# Altium schematic sheet LDO.SchDoc
size A4; SheetNumber: 3; SheetTotal: 5
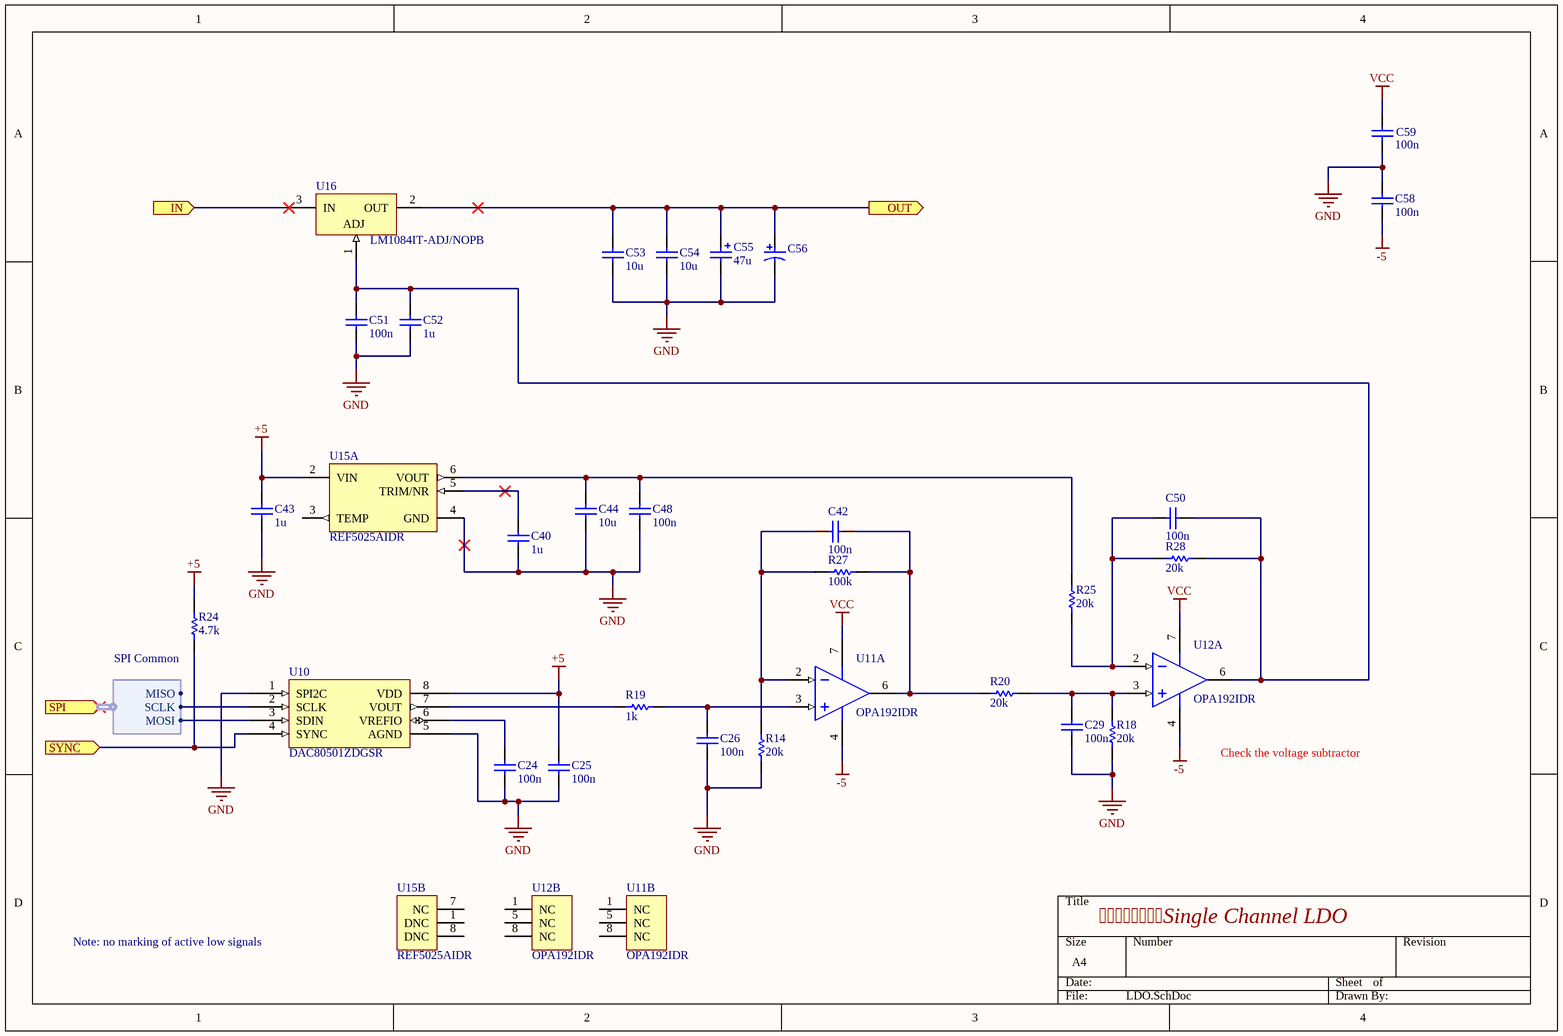
[diagram p0: LDO.SchDoc]

## Parts
C24  100n  [CAPC2013X145X50LL20T25]
C25  100n  [CAPC2013X145X50LL20T25]
C26  100n  [CAPC2013X145X50NL20T25]
C29  100n  [CAPC2013X145X50NL20T25]
C40  1u  [CAPC2013X140X50LL20T25]
C42  100n  [CAPC2013X145X50NL20T25]
C43  1u  [CAPC2013X140X50LL20T25]
C44  10u  [CAPC3216X180X55LL20T30]
C48  100n  [CAPC2013X145X50LL20T25]
C50  100n  [CAPC2013X145X50NL20T25]
C51  100n  [CAPC2013X145X50LL20T25]
C52  1u  [CAPC2013X140X50LL20T25]
C53  10u  [CAPC3216X180X55LL20T30]
C54  10u  [CAPC3216X180X55LL20T30]
C55  47u  [7343]
C56  ECA-1JHG471  [CAPPR65-500-2000X1250X2200]  (value not drawn)
C58  100n  [CAPC2013X145X50LL20T25]
C59  100n  [CAPC2013X145X50LL20T25]
R14  20k  [RESC2013X70X40NL20T20]
R18  20k  [RESC2013X70X40NL20T20]
R19  1k  [RESC2013X50X30NL20T20]
R20  20k  [RESC2013X70X40NL20T20]
R24  4.7k  [RESC2013X70X40NL20T20]
R25  20k  [RESC2013X70X40NL20T20]
R27  100k  [RESC2013X70X40NL20T20]
R28  20k  [RESC2013X70X40NL20T20]
U10  DAC80501ZDGSR  [MSOP10]
U11  OPA192IDR  [D0008A_M]  (parts A,B of 2)
U12  OPA192IDR  [D0008A_M]  (parts A,B of 2)
U15  REF5025AIDR  [D0008A_L]  (parts A,B of 2)
U16  LM1084IT-ADJ/NOPB  [NDE0003A]

## Ports
IN (in), OUT (out), SPI (in, harness SPI Common), SYNC (in)

## Harnesses
SPI Common: MISO, MOSI, SCLK

## Nets
+5: C25.1 C43.2 R24.2 U10.8(VDD) U15.2(VIN)
-5: C58.2 U11.4(V-) U12.4(V-)
GND: C24.2 C25.2 C26.2 C29.2 C40.1 C43.1 C44.1 C48.2 C51.2 C52.1 C53.1 C54.1 C55.2 C56.2 C58.1 C59.2 R14.1 R18.1 U10.1(SPI2C) U10.5(AGND) U15.4(GND)
VCC: C59.1 U11.7(V+) U12.7(V+)
IN: U16.3(IN) ; port IN
OUT: C53.2 C54.2 C55.1 C56.1 U16.2(OUT) ; port OUT
SYNC: R24.1 U10.4(SYNC) ; port SYNC
NetC24_1: C24.1 U10.6(VREFIO)
NetC26_1: C26.1 R19.1 U11.3(IN+)
NetC29_1: C29.1 R18.2 R20.2 U12.3(IN+)
NetC40_2: C40.2 U15.5(TRIM/NR)
NetC42_1: C42.1 R20.1 R27.2 U11.6(OUT)
NetC42_2: C42.2 R14.2 R27.1 U11.2(IN-)
NetC44_2: C44.2 C48.1 R25.2 U15.6(VOUT)
NetC50_1: C50.1 C51.1 C52.2 R28.1 U12.6(OUT) U16.1(ADJ)
NetC50_2: C50.2 R25.1 R28.2 U12.2(IN-)
NetR19_2: R19.2 U10.7(VOUT)
NetU10_2: U10.2(SCLK) ; port SPI.SCLK
NetU10_3: U10.3(SDIN) ; port SPI.MOSI

Not connected (* = marked no-connect by the designer): U11 1(NC) 5(NC) 8(NC); U12 1(NC) 5(NC) 8(NC); U15 1(DNC) 3(TEMP) 7(NC) 8(DNC)

## Notes on the sheet
- (near U12) Check the voltage subtractor
- Single Channel LDO
- Note: no marking of active low signals

## Library data of the parts
C24-C26 C29 C42 C48 C50 C51 C58 C59 = CMP-2007-01136-1: Manufacturer: Kemet; Part Number: C0805C104K3RALTU
C40 C43 C52 = CMP-2007-03234-1: Part Number: C0805C105K3RACTU; Manufacturer: Kemet
C44 C53 C54 = CMP-2000-07261-1: High Value Multilayer Ceramic Capacitor, 10 uF, +/- 10%, 25 V, -55 to 125 degC, 1206 (3216 Metric), RoHS, Tape and Reel; Manufacturer: Taiyo Yuden; Catalog Drawings: xMKSeries_1206_1.6; Temperature Coefficient: X7R; Other Names: 587-2399-6; Capacitance: 10µF; Online Catalog: MSeries; Voltage - Rated: 25V; Package / Case: 1206(3216Metric); Thickness (Max): 0.071"(1.80mm); Tolerance: ±10%; Category: Capacitors; Size / Dimension: 0.126"Lx0.063"W(3.20mmx1.60mm); Lead Spacing: -; Standard Package: 1; Applications: GeneralPurpose; Features: -; Package Description: 2-Pin Surface Mount Device, Body 3.2 x 1.6 mm; Package Reference: 1206; Datasheet Version: 07/2015; Lead Style: -; Manufacturer URL: http://www.t-yuden.com/; Mounting Technology: SurfaceMount; Height - Seated (Max): -; Mounting Type: SurfaceMount,MLCC; Datasheet URL: http://datasheet.octopart.com/TMK316B7106KL-TD-Taiyo-Yuden-datasheet-62109620.pdf; Operating Temperature: -55°C~125°C; Series: M; Ratings: -; Packaging: Digi-Reel®; Family: CeramicCapacitors
C55 = T521X476M035ATE030: KEMET - T521X476M035ATE030 - CAP, TANT, POLYMER, 47UF, 35V, CASE X; pin to pad: 1>2 2>1; Tolerance: 20%; ESR (Equivalent Series Resistance): 30mR; Polarity: Polar; Life (Hours): 2000Hour; Dissipation Factor: 10%; Supplier 1: RSComponents; Manufacturer: KEMET; Manufacturer Part Number: T521X476M035ATE030; RoHS: Yes; Category: Polymer Capacitors; Stock 1: 1; Pricing 1: 500=2.79100, 1500=2.59300 (USD); Mount: Surface Mount; Case/Package: 2917; Number of Pins: 2; Case Code (Imperial): 2917; Case Code (Metric): 7343; Min Operating Temperature: -55°C; Max Operating Temperature: 125°C; Capacitance: 47uF; Voltage Rating: 35V; Packaging: Tape and Reel; Package Quantity: 1; Voltage Rating (DC): 35V; Termination: SMD/SMT; Features: General Purpose; Series: KO-CAP T521; Construction: Flat; Length: 7.3mm; Width: 4.3mm; Height: 4mm; Height - Seated (Max): 0.169inch; Depth: 4.3mm; RoHS Compliant: Yes; REACH SVHC: No SVHC; ComponentLink1URL: https://datasheet.ciiva.com/7759/1056102-7759041.pdf?src-supplier=Element14; ComponentLink1Description: https://datasheet.ciiva.com/7759/1056102-7759041.pdf?src-supplier=Element14; ComponentLink2URL: https://datasheet.ciiva.com/262/kem-t2016-t521-262925.pdf?src-supplier=Digi-Key; ComponentLink2Description: https://datasheet.ciiva.com/262/kem-t2016-t521-262925.pdf?src-supplier=Digi-Key; ComponentLink3URL: https://datasheet.ciiva.com/262/kem-t2016-t521-262927.pdf?src-supplier=Digi-Key; ComponentLink3Description: https://datasheet.ciiva.com/262/kem-t2016-t521-262927.pdf?src-supplier=Digi-Key; ComponentLink4URL: https://datasheet.ciiva.com/22698/1899432-22698968.pdf?src-supplier=Element14; ComponentLink4Description: https://datasheet.ciiva.com/22698/1899432-22698968.pdf?src-supplier=Element14; ComponentLink5URL: https://datasheet.ciiva.com/262/kem-t2016-t521-262926.pdf?src-supplier=Digi-Key; ComponentLink5Description: https://datasheet.ciiva.com/262/kem-t2016-t521-262926.pdf?src-supplier=Digi-Key; Supplier Part Number 1: 1447217
C56 = CMP-1665-00014-4: Aluminum Electrolytic Capacitor (Radial Lead Type), 470 uF, 63 V, -55 to 105 degC, 2-Pin THD, RoHS, Bulk; Manufacturer: Panasonic; Voltage Rating: 63 V; Lead Pitch: 5 mm; ComponentLink2URL: http://industrial.panasonic.com/cdbs/www-data/pdf/RDF0000/ABA0000C1038.pdf; DatasheetVersion: 03/2016; ComponentLink1URL: http://www.panasonic.com/; Mount: Through Hole; Max Operating Temperature: 105 degC; Pins: 2; Packaging: Bulk; ComponentLink1Description: Manufacturer URL; Height: 20 mm; REACH SVHC: No SVHC; RoHSCompliant: true; Mounting Technology: Through Hole; PackageDescription: 2-Pin Through Hole Device, Dia 12.5 mm, Body Length 20 mm; Package Quantity: 200; Min Operating Temperature: -55 degC; PackageReference: Radial; ComponentLink2Description: Datasheet; Length: 20 mm
R14 R18 R20 R25 R28 = CMP-2001-00371-1: Manufacturer: Panasonic; Part Number: ERJ-6GEYJ203V
R19 = CMP-1013-00510-2: Part Number: CRCW08051K00FKEA; Manufacturer: Vishay Dale
R24 = CMP-2001-00420-1: Manufacturer: Panasonic; Part Number: ERJ-6GEYJ472V
R27 = CMP-2001-00338-1: Part Number: ERJ-6GEYJ104V; Manufacturer: Panasonic
U10 = DAC80501ZDGSR: pin to pad: 1>5 2>6 3>8 4>7 5>4 6>10 7>2 8>1; Manufacturer: Texas Instruments; Supplier 1: Digi-Key; RoHS: Yes; Stock 1: 1616; Pricing 1: 1=6.15000, 10=5.52700, 25=5.22560, 100=4.52880, 250=4.29656, 500=3.85528, 1000=3.83425 (USD); Supplier Part Number 1: 296-DAC80501ZDGSRCT-ND; Manufacturer Part Number: DAC80501ZDGSR
U11 U12 = CMP-0272-04159-2: Precision, Rail-to-Rail Input/Output, Low Offset Voltage, Low Input Bias Current Op Amp with E-trim, 4.5 to 36 V, -40 to 125 degC, 8-Pin SOIC (D), Green (RoHS & no Sb/Br), Tape and Reel; VS Min: 4.5 V; Channel: 1; Slew Rate: 20 V/us; VS Max: 36 V; Packing: Tape and Reel; ComponentLink3Description: Package Specification; Code_JEDEC: MS-012; PackageVersion: 4040047-3/M, 06/2011; ComponentLink1Description: Manufacturer URL; PartNumber: OPA192IDR; ComponentLink1URL: http://www.ti.com/; ComponentLink2URL: http://www.ti.com/lit/ds/symlink/opa192.pdf; Temperature Max: 125 degC; Temperature Min: -40 degC; Mounting Technology: Surface Mount; RoHS: TRUE; ComponentLink3URL: http://www.ti.com/lit/ml/msoi002j/msoi002j.pdf; PackageDescription: 8-Pin Plastic Small Outline, Body 4.9 x 3.9 mm, Pitch 1.27 mm; DatasheetVersion: SBOS620D; PackageReference: D0008A; ComponentLink2Description: Datasheet
U15 = CMP-0367-00041-2: Low Noise, Very Low Drift, Precision Voltage Reference, -40 to 125 degC, 8-pin SOIC (D), Green (RoHS & no Sb/Br); Manufacturer: Texas Instruments; VO(V): 2.5; Iout/Iz(Max)(mA): 10; Initial Accuracy @ 25/deg C(%): 0.05; VI(Max)(V): 18; Iq(Max)(uA): 1000; Rating: Military; Temp Coeff(Max)(ppm/ degree C): 3; SubFamily: Series Voltage Reference; VI(Min)(V): 2.7; DatasheetVersion: SBOS410E; Eco-Plan: Green (RoHS & no Sb/Br); ComponentLink2URL: http://www.ti.com/general/docs/lit/getliterature.tsp?genericPartNumber=REF5025&fileType=pdf; PackageVersion: 4040047-3/M; PackageDescription: 8-Pin Plastic Small Outline, Body 4.9 x 3.9 mm, Pitch 1.27 mm; PartNumber: REF5025AIDR; ComponentLink3Description: Package Specification; ComponentLink1URL: http://www.ti.com/; ComponentLink1Description: Manufacturer URL; PackageReference: D0008A; ComponentLink3URL: http://www.ti.com/litv/pdf/msoi002j; Mounting Technology: Surface Mount; ComponentLink2Description: Datasheet; Code_JEDEC: MS-012
U16 = CMP-0062-02529-3: 5A Low Dropout Positive Regulators, 3-pin TO-220, Pb-Free; Manufacturer: Texas Instruments; CompType: LDO IC; PackageTopMarking: NSUZXYTTE#*LM1084*IT-ADJ; PowerWise: N; ComponentLink1Description: Datasheet URL; ComponentLink1URL: http://www.ti.com/general/docs/lit/getliterature.tsp?genericPartNumber=LM1084&fileType=pdf; PackageDescription: TO-220, Molded, 3 Lead, Straight; PinCount: 3; PackageReference: NDE0003A; RoHS: Y